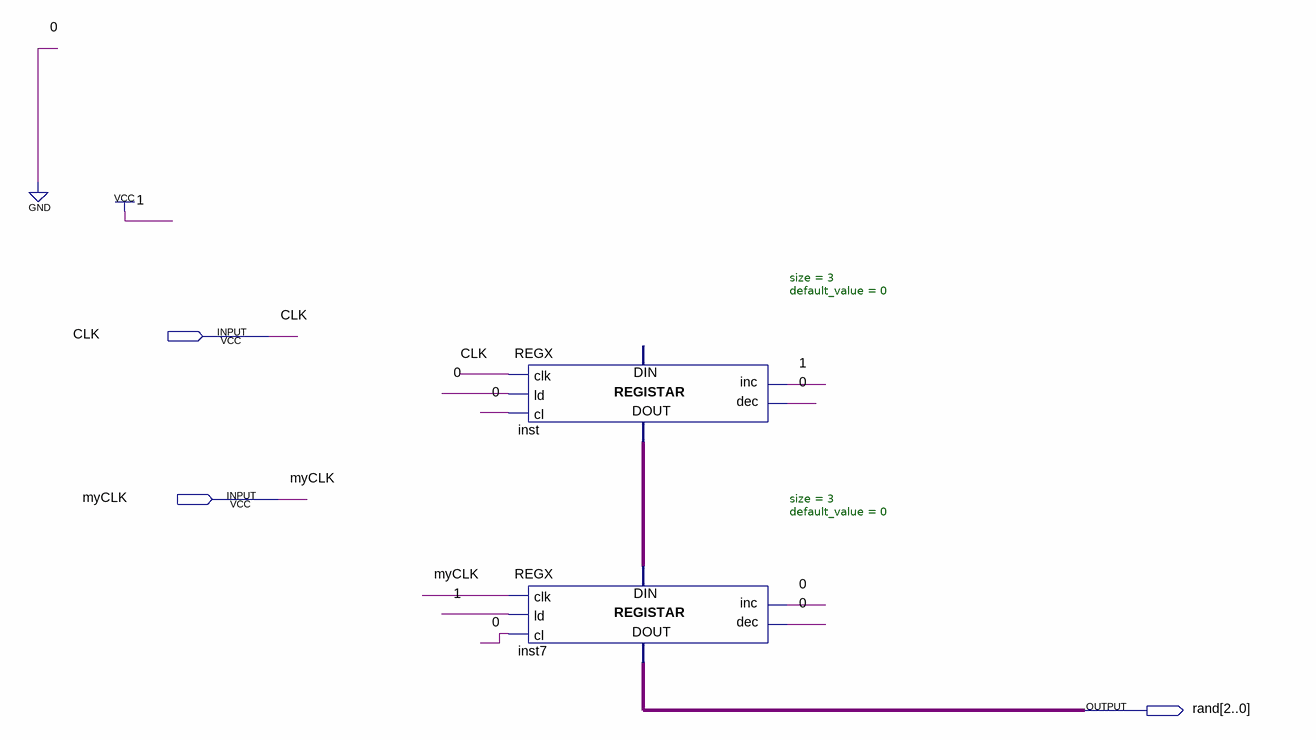
[diagram p0: schematic sheet]
// Quartus schematic RandomGen.bdf as structural Verilog: 2 symbols, 3 pins
module RandomGen (
  input  CLK,
  input  myCLK,
  output [2:0] \rand 
);

  wire [2:0] inst_data_out;

  REGX #(.size(3), .default_value(0)) inst (
    .clk(CLK), .ld(1'b0), .cl(1'b0), .inc(1'b1), .dec(1'b0), .data_out(inst_data_out));  // open: data_in
  REGX #(.size(3), .default_value(0)) inst7 (
    .clk(myCLK), .ld(1'b1), .cl(1'b0), .inc(1'b0), .dec(1'b0), .data_in(inst_data_out), .data_out(\rand ));
endmodule
